# EAGLE schematic schaltung (EAGLE 7.5.0)
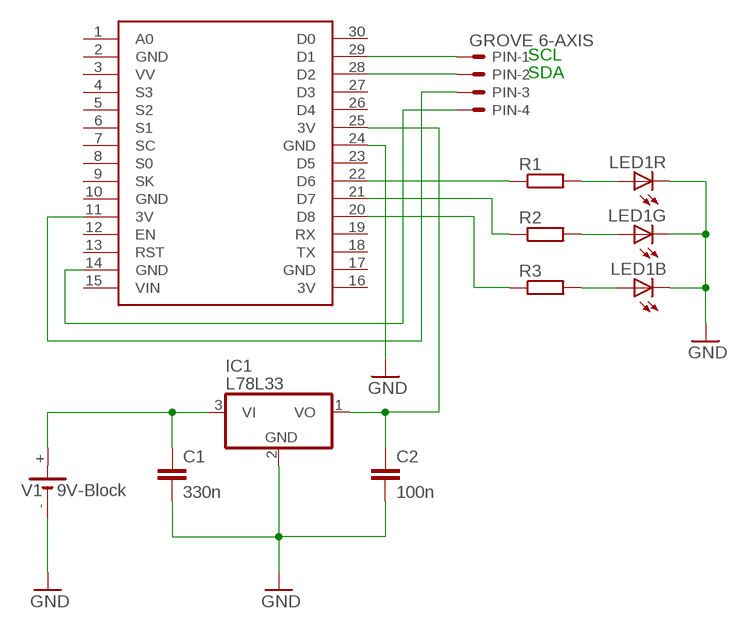
[diagram p0: schematic, sheet 1]

## Parts
C1  330n  C2,5-3  [C2.5-3]
C2  100n  C2,5-3  [C2.5-3]
IC1  L78L33  78L05Z  [TO92]
LED1  GM5WA94310A  [GM5WA94310A]
PIN  GROVE 6-AXIS  22-23-2041  [22-23-2041]
R1  R-EU_0204/7  [0204/7]
R2  R-EU_0204/7  [0204/7]
R3  R-EU_0204/7  [0204/7]
U$1  NODEMCU  [NODEMCU]
V1  9V-Block  SL-340/P  [BEL/P]

## Nets
GND: C1.2 C2.2 IC1.2(GND) LED1.4(G:C) LED1.5(R:C) LED1.6(B:C) U$1.24(GND) V1.-
N$1: C1.1 IC1.3(VI) V1.+
N$2: C2.1 IC1.1(VO) U$1.25(3V)
N$3: PIN.1 U$1.29(D1)
N$4: PIN.2 U$1.28(D2)
N$5: LED1.2(R:A) R1.2
N$6: PIN.4 U$1.14(GND)
N$7: PIN.3 U$1.11(3V)
N$8: LED1.3(G:A) R2.2
N$9: LED1.1(B:A) R3.2
N$10: R1.1 U$1.22(D6)
N$11: R2.1 U$1.21(D7)
N$12: R3.1 U$1.20(D8)
Unconnected: U$1.1(A0) U$1.3(VV) U$1.4(S3) U$1.5(S2) U$1.6(S1) U$1.7(SC) U$1.8(S0) U$1.9(SK) U$1.12(EN) U$1.13(RST) U$1.15(VIN) U$1.18(TX) U$1.19(RX) U$1.23(D5) U$1.26(D4) U$1.27(D3) U$1.30(D0)

## Notes on the sheet
- SCL
- SDA

## Power pins joined to a net without a drawn wire
3V: U$1.16(3V)
GND: U$1.2(GND) U$1.10(GND) U$1.17(GND)

## Library data of the parts
C1 C2 = capacitor-wima:C: CAPACITOR naming: grid - package width
IC1 = linear:78*: Positive VOLTAGE REGULATOR Source: http://cache.national.com/ds/LM/LM78L05.pdf http://www.fairchildsemi.com/ds/LM/LM7805.pdf
LED1 = led:GM5WA94310A: Chip LED RGB Source: http://document.sharpsma.com/files/GM5WA94310A_SS.pdf
PIN = con-molex:22-23-2041: .100" (2.54mm) Center Header - 4 Pin; MF: MOLEX; MPN: 22-23-2041; OC_FARNELL: 1462920; OC_NEWARK: 38C0355
R1-R3 = rcl:R-EU_: RESISTOR, European symbol
U$1 = nodemcu:NODEMCU
V1 = battery:SL-340/P: LI BATTERY Sonnenschein SL-340